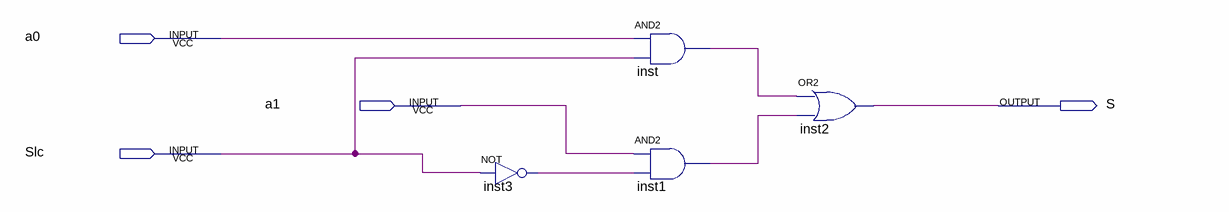
[diagram p0: schematic sheet]
// Quartus schematic Mux.bdf as structural Verilog: 4 symbols, 4 pins
module Mux (
  input  a0,
  input  a1,
  input  Slc,
  output S
);

  wire inst1_out, inst3_out, inst_out;

  not inst3 (inst3_out, Slc);
  and inst (inst_out, a0, Slc);
  and inst1 (inst1_out, a1, inst3_out);
  or inst2 (S, inst_out, inst1_out);
endmodule
